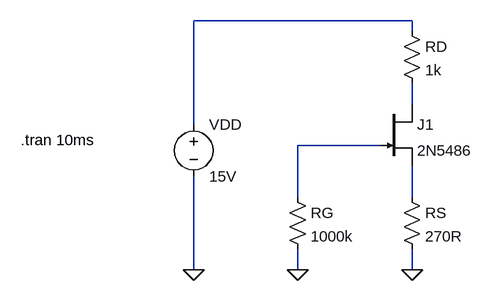
[diagram p0: schematic jfet-autopolarization.asc]
jfet-autopolarization.asc, the LTspice schematic file:
Version 4
SHEET 1 880 680
WIRE 240 -32 -96 -32
WIRE 240 -16 240 -32
WIRE 240 96 240 64
WIRE -96 128 -96 -32
WIRE 192 160 64 160
WIRE 64 240 64 160
WIRE 240 240 240 192
WIRE -96 352 -96 208
WIRE 64 352 64 320
WIRE 240 352 240 320
FLAG -96 352 0
FLAG 64 352 0
FLAG 240 352 0
SYMBOL njf 192 96 R0
SYMATTR InstName J1
SYMATTR Value 2N5486
SYMBOL res 224 224 R0
SYMATTR InstName RS
SYMATTR Value 270R
SYMBOL res 224 -32 R0
SYMATTR InstName RD
SYMATTR Value 1k
SYMBOL res 48 224 R0
SYMATTR InstName RG
SYMATTR Value 1000k
SYMBOL voltage -96 112 R0
WINDOW 123 0 0 Left 0
WINDOW 39 0 0 Left 0
SYMATTR InstName VDD
SYMATTR Value 15V
TEXT -362 152 Left 2 !.tran 10ms

The netlist it stands for:
* jfet-autopolarization.asc
J1 N002 N003 N004 2N5486
RS N004 0 270R
RD N001 N002 1k
RG N003 0 1000k
VDD N001 0 15V
.model NJF NJF
.model PJF PJF
.lib standard.jft
.tran 10ms
.backanno
.end